# Altium project BLAX_PROD_01_STD_1370_V01.PrjPcb (part 2 of 2)

## Sheet LED_DRIVER.SchDoc
size A3; SheetNumber: 12; SheetTotal: 16
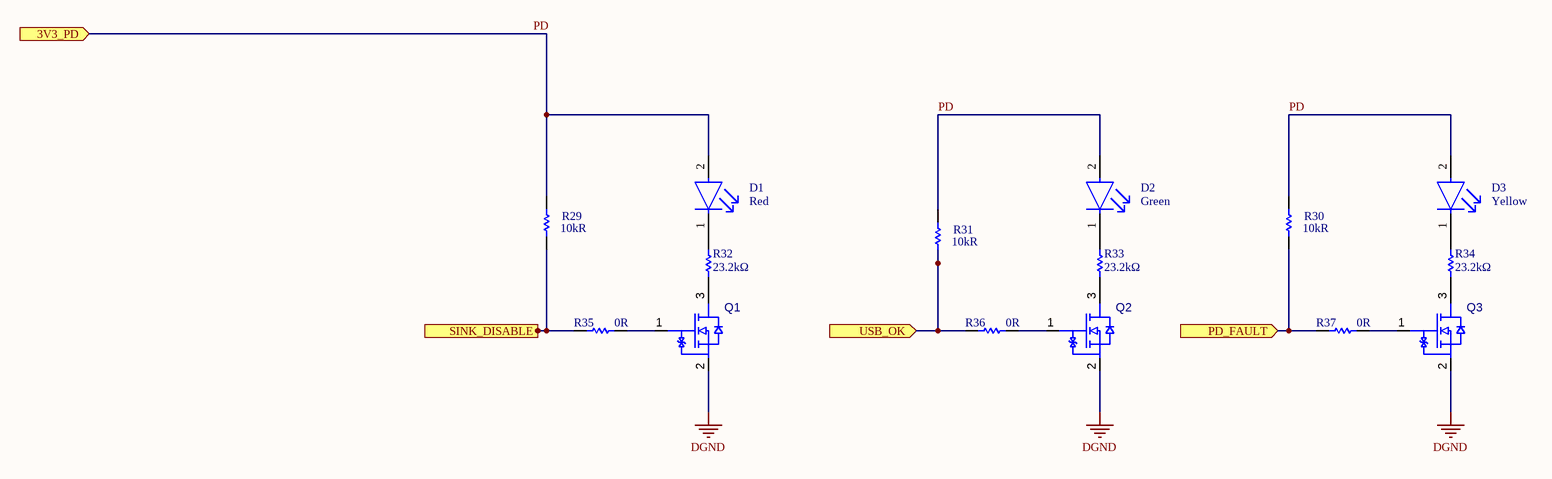
[diagram p12: LED_DRIVER.SchDoc]

### Parts
D1  value Red  [FP-VLMO1500-GS08-MFG]  (hidden comment: VLMS1500-GS08)
D2  value Green  [FP-VLMO1500-GS08-MFG]  (hidden comment: VLMG1500-GS08)
D3  value Yellow  [FP-VLMO1500-GS08-MFG]  (hidden comment: VLMY1500-GS08)
Q1  RUM002N05T2L  [ROHM-SOT723-3_V]  (value not drawn)
Q2  RUM002N05T2L  [ROHM-SOT723-3_V]  (value not drawn)
Q3  RUM002N05T2L  [ROHM-SOT723-3_V]  (value not drawn)
R29  value 10kR  [RESC1005X40X25LL10T10]  (hidden comment: RK73H1ETTP1002F)
R30  value 10kR  [RESC1005X40X25LL10T10]  (hidden comment: RK73H1ETTP1002F)
R31  value 10kR  [RESC1005X40X25LL10T10]  (hidden comment: RK73H1ETTP1002F)
R32  value 23.2kΩ  [RESC1005X40X25LL10T10]  (hidden comment: RK73H1ETTP2322F)
R33  value 23.2kΩ  [RESC1005X40X25LL10T10]  (hidden comment: RK73H1ETTP2322F)
R34  value 23.2kΩ  [RESC1005X40X25LL10T10]  (hidden comment: RK73H1ETTP2322F)
R35  value 0R  [FP-RK73Z1E-IPC_B]  (hidden comment: RK73Z1ETTP)
R36  value 0R  [FP-RK73Z1E-IPC_B]  (hidden comment: RK73Z1ETTP)
R37  value 0R  [FP-RK73Z1E-IPC_B]  (hidden comment: RK73Z1ETTP)

### Ports
3V3_PD (in), PD_FAULT (in), SINK_DISABLE (in), USB_OK (in)

### Nets
DGND: Q1.2(S) Q2.2(S) Q3.2(S)
PD: D1.2(A) D2.2(A) D3.2(A) R29.1 R30.1 R31.1 ; port 3V3_PD  [project net 3V3_PD]
BAD_INPUT: R30.2 R37.1 ; port PD_FAULT
PD_OK: R31.2 R36.1 ; port USB_OK
SINK_EN: R29.2 R35.1 ; port SINK_DISABLE
NetD1_1: D1.1(C) R32.2
NetD2_1: D2.1(C) R33.2
NetD3_1: D3.1(C) R34.2
NetQ1_1: Q1.1(G) R35.2
NetQ1_3: Q1.3(D) R32.1
NetQ2_1: Q2.1(G) R36.2
NetQ2_3: Q2.3(D) R33.1
NetQ3_1: Q3.1(G) R37.2
NetQ3_3: Q3.3(D) R34.1

### Library data of the parts
D1 = CMP-00030-24098164-1: RED 0402 VLMx1500; Luminous Intensity: 90mcd; Dominant Wavelength: 605nm; Forward Voltage: 2V; Test Current: 20mA; Lens Style: Rectangular, Square; Reverse Voltage: 5V; Power Rating: 75mW; Illumination Color: Orange; Viewing Angle: 130°; Number of LEDs: 1; NexarPartId: 24098164; Ambient Temperature Range High: 85°C; Wavelength: 605nm; Schedule B: 8541402000, 8541402000; Number of Pins: 2; Length: 1mm; Width: 500µm; Case/Package: 0402; RoHS: Compliant; Packaging: Cut Tape; Radiation Hardening: No; Case Code (Imperial): 0402; Lead Free: Lead Free; Case Code (Metric): 1005; Forward Current: 20mA; Color: Orange; Min Operating Temperature: -30°C; Height: 350µm; Max Operating Temperature: 85°C; Mount: Surface Mount; Power Dissipation: 75mW
D2 = CMP-00030-24098164-1: GREEN 0402 VLMx1500; Luminous Intensity: 90mcd; Dominant Wavelength: 605nm; Forward Voltage: 2V; Test Current: 20mA; Lens Style: Rectangular, Square; Reverse Voltage: 5V; Power Rating: 75mW; Illumination Color: Orange; Viewing Angle: 130°; Number of LEDs: 1; NexarPartId: 24098164; Ambient Temperature Range High: 85°C; Wavelength: 605nm; Schedule B: 8541402000, 8541402000; Number of Pins: 2; Length: 1mm; Width: 500µm; Case/Package: 0402; RoHS: Compliant; Packaging: Cut Tape; Radiation Hardening: No; Case Code (Imperial): 0402; Lead Free: Lead Free; Case Code (Metric): 1005; Forward Current: 20mA; Color: Orange; Min Operating Temperature: -30°C; Height: 350µm; Max Operating Temperature: 85°C; Mount: Surface Mount; Power Dissipation: 75mW
D3 = CMP-00030-24098164-1: YELLOW 0402 VLMx1500; Luminous Intensity: 90mcd; Dominant Wavelength: 605nm; Forward Voltage: 2V; Test Current: 20mA; Lens Style: Rectangular, Square; Reverse Voltage: 5V; Power Rating: 75mW; Illumination Color: Orange; Viewing Angle: 130°; Number of LEDs: 1; NexarPartId: 24098164; Ambient Temperature Range High: 85°C; Wavelength: 605nm; Schedule B: 8541402000, 8541402000; Number of Pins: 2; Length: 1mm; Width: 500µm; Case/Package: 0402; RoHS: Compliant; Packaging: Cut Tape; Radiation Hardening: No; Case Code (Imperial): 0402; Lead Free: Lead Free; Case Code (Metric): 1005; Forward Current: 20mA; Color: Orange; Min Operating Temperature: -30°C; Height: 350µm; Max Operating Temperature: 85°C; Mount: Surface Mount; Power Dissipation: 75mW
Q1-Q3 = CMP-013-00026-2: Nch Small Signal MOSFET, 50 V, 200 mA, 3-Pin SOT723, RoHS, Tape and Reel; Vgs(th) (Max) @ Id: 1V@1mA; Pins: 3
R29-R31 = CMP-x00150-1: Fixed Resistor, Metal Glaze/thick Film, 0.1W, 10000ohm, 75V, 1% +/-Tol, 100ppm/Cel, Surface Mount, 0402
R32-R34 = CMP-009-00229-1: Fixed Resistor, Metal Glaze/thick Film, 0.1W, 23200ohm, 75V, 1% +/-Tol, 100ppm/Cel, Surface Mount, 0402; Vendor: TTI; Rating: 1/10W; Category: Resistor; Package: 0402; Price: 0.00295
R35-R37 = CMP-x00147-1: Metal Glaze/thick Film, 0ohm, Surface Mount, 0402

## Sheet AUX1.SchDoc
size A4
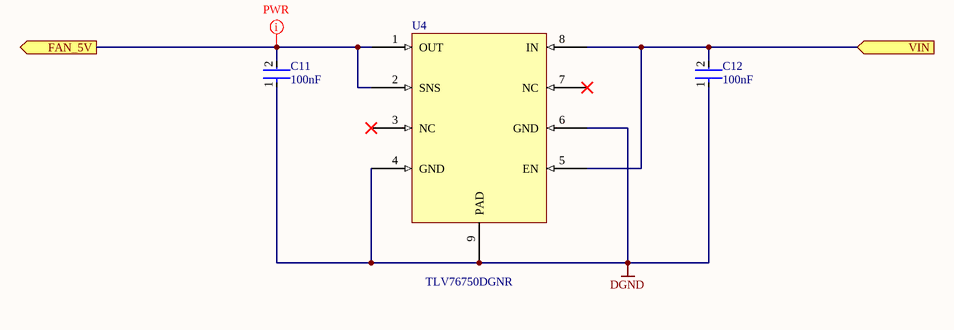
[diagram p13: AUX1.SchDoc]

### Parts
C11  value 100nF  [FP-CC0402-IPC_B]  (hidden comment: CC0402KRX7R9BB104)
C12  value 100nF  [FP-CC0402-IPC_B]  (hidden comment: CC0402KRX7R9BB104)
U4  TLV76750DGNR  [TLV76708DGNR-Footprint-1]

### Ports
FAN_5V (out), VIN (in)

### Nets
DGND: C11.1 C12.1 U4.4(GND) U4.6(GND) U4.9(PAD)
3V3_IN: C12.2 U4.5(EN) U4.8(IN) ; port VIN
FS: C11.2 U4.1(OUT) U4.2(SNS) ; port FAN_5V

Not connected (* = marked no-connect by the designer): U4 3(NC)* 7(NC)*

### Layout directives
net class PWR: FS

### Library data of the parts
C11 C12 = CMP-x00152-1: Ceramic Capacitor, Multilayer, Ceramic, 50V, 10% +Tol, 10% -Tol, X7R, 15% TC, 0.1uF, Surface Mount, 0402
U4 = CMP-x00161-4: Adjustable- and fixed-output, 1-A, 16-V, positive-voltage low-dropout (LDO) linear regulator 8-HVSSOP -40 to 125; Manufacturer: TI; Template: TI_HVSSOP; Reel Width: 12mm; Mounting: SMD; Category: IC; Package: HVSSOP; MOQ: 2500

## Nets that join several sheets
3V3_ESP: Main (TP4.1), 1V2-BUCK (R80.2), Fan (C21.1 R28.2 U7.1), BM_EXT_PWR (6 pins), ESP32 (9 pins), LOGIC_SUPPLY (8 pins), DISPLAY (J1.2)
3V3_PD: USB-PD (9 pins), LED_DRIVER (6 pins)
DGND: Main (10 pins), 1V2-BUCK (37 pins), BM1370 (18 pins), Fan (6 pins), USB-PD (49 pins), BM_EXT_PWR (11 pins), BM1370_REFCLK (C10.2 Y1.2), ESP32 (25 pins), LOGIC_SUPPLY (19 pins), DISPLAY (J1.1), LED_DRIVER (Q1.2 Q2.2 Q3.2), AUX1 (5 pins)
0V8_REF: BM1370 (C6.1 U3.14), BM_EXT_PWR (C1.2 TP13.1 U1.1 U1.2)
1V2: BM1370 (C7.1 R3.2 U3.15), BM_EXT_PWR (5 pins), BM1370_REFCLK (C10.1 R9.2 Y1.4), ESP32 (C19.2 U6.5 U6.6 U6.14)
3V3_IN: 1V2-BUCK (20 pins), USB-PD (C41.1 Q4.5 R47.2 U8.19), LOGIC_SUPPLY (8 pins), AUX1 (C12.2 U4.5 U4.8)
BAD_INPUT: USB-PD (U8.6), LED_DRIVER (R30.2 R37.1)
FS: Fan (5 pins), AUX1 (C11.2 U4.1 U4.2)
MINER_CLK: BM1370 (TP19.1 U3.8), BM1370_REFCLK (Y1.3)
MINER_RST: BM1370 (R5.2 TP16.1 U3.5), ESP32 (U6.1)
MINER_RX: BM1370 (TP18.1 U3.7), ESP32 (U6.3)
MINER_TEMP_N: BM1370 (U3.21), Fan (R26.1 TP26.1)
MINER_TEMP_P: BM1370 (U3.20), Fan (R25.1 TP25.1)
MINER_TX: BM1370 (TP17.1 U3.6), ESP32 (U6.2)
PD_OK: USB-PD (U8.31), LED_DRIVER (R31.2 R36.1)
PG_ESP: 1V2-BUCK (R80.1 TP39.1 U10.1), ESP32 (U5.19)
SCL: 1V2-BUCK (U10.3), Fan (U7.8), USB-PD (U8.9), ESP32 (R23.1 TP22.1 U5.25), DISPLAY (J1.3)
SDA: 1V2-BUCK (U10.2), Fan (U7.7), USB-PD (U8.8), ESP32 (R22.1 TP24.1 U5.24), DISPLAY (J1.4)
SINK_EN: USB-PD (U8.18), LED_DRIVER (R29.2 R35.1)
SMB: 1V2-BUCK (U10.6), ESP32 (U5.21)
USB_N: USB-PD (J4.A7 J4.B7), ESP32 (U5.13)
USB_P: USB-PD (J4.A6 J4.B6), ESP32 (U5.14)
VCORE: 1V2-BUCK (12 pins), BM1370 (5 pins), ESP32 (U5.38)